# EAGLE schematic DevBoard Schematic (EAGLE 9.7.0)
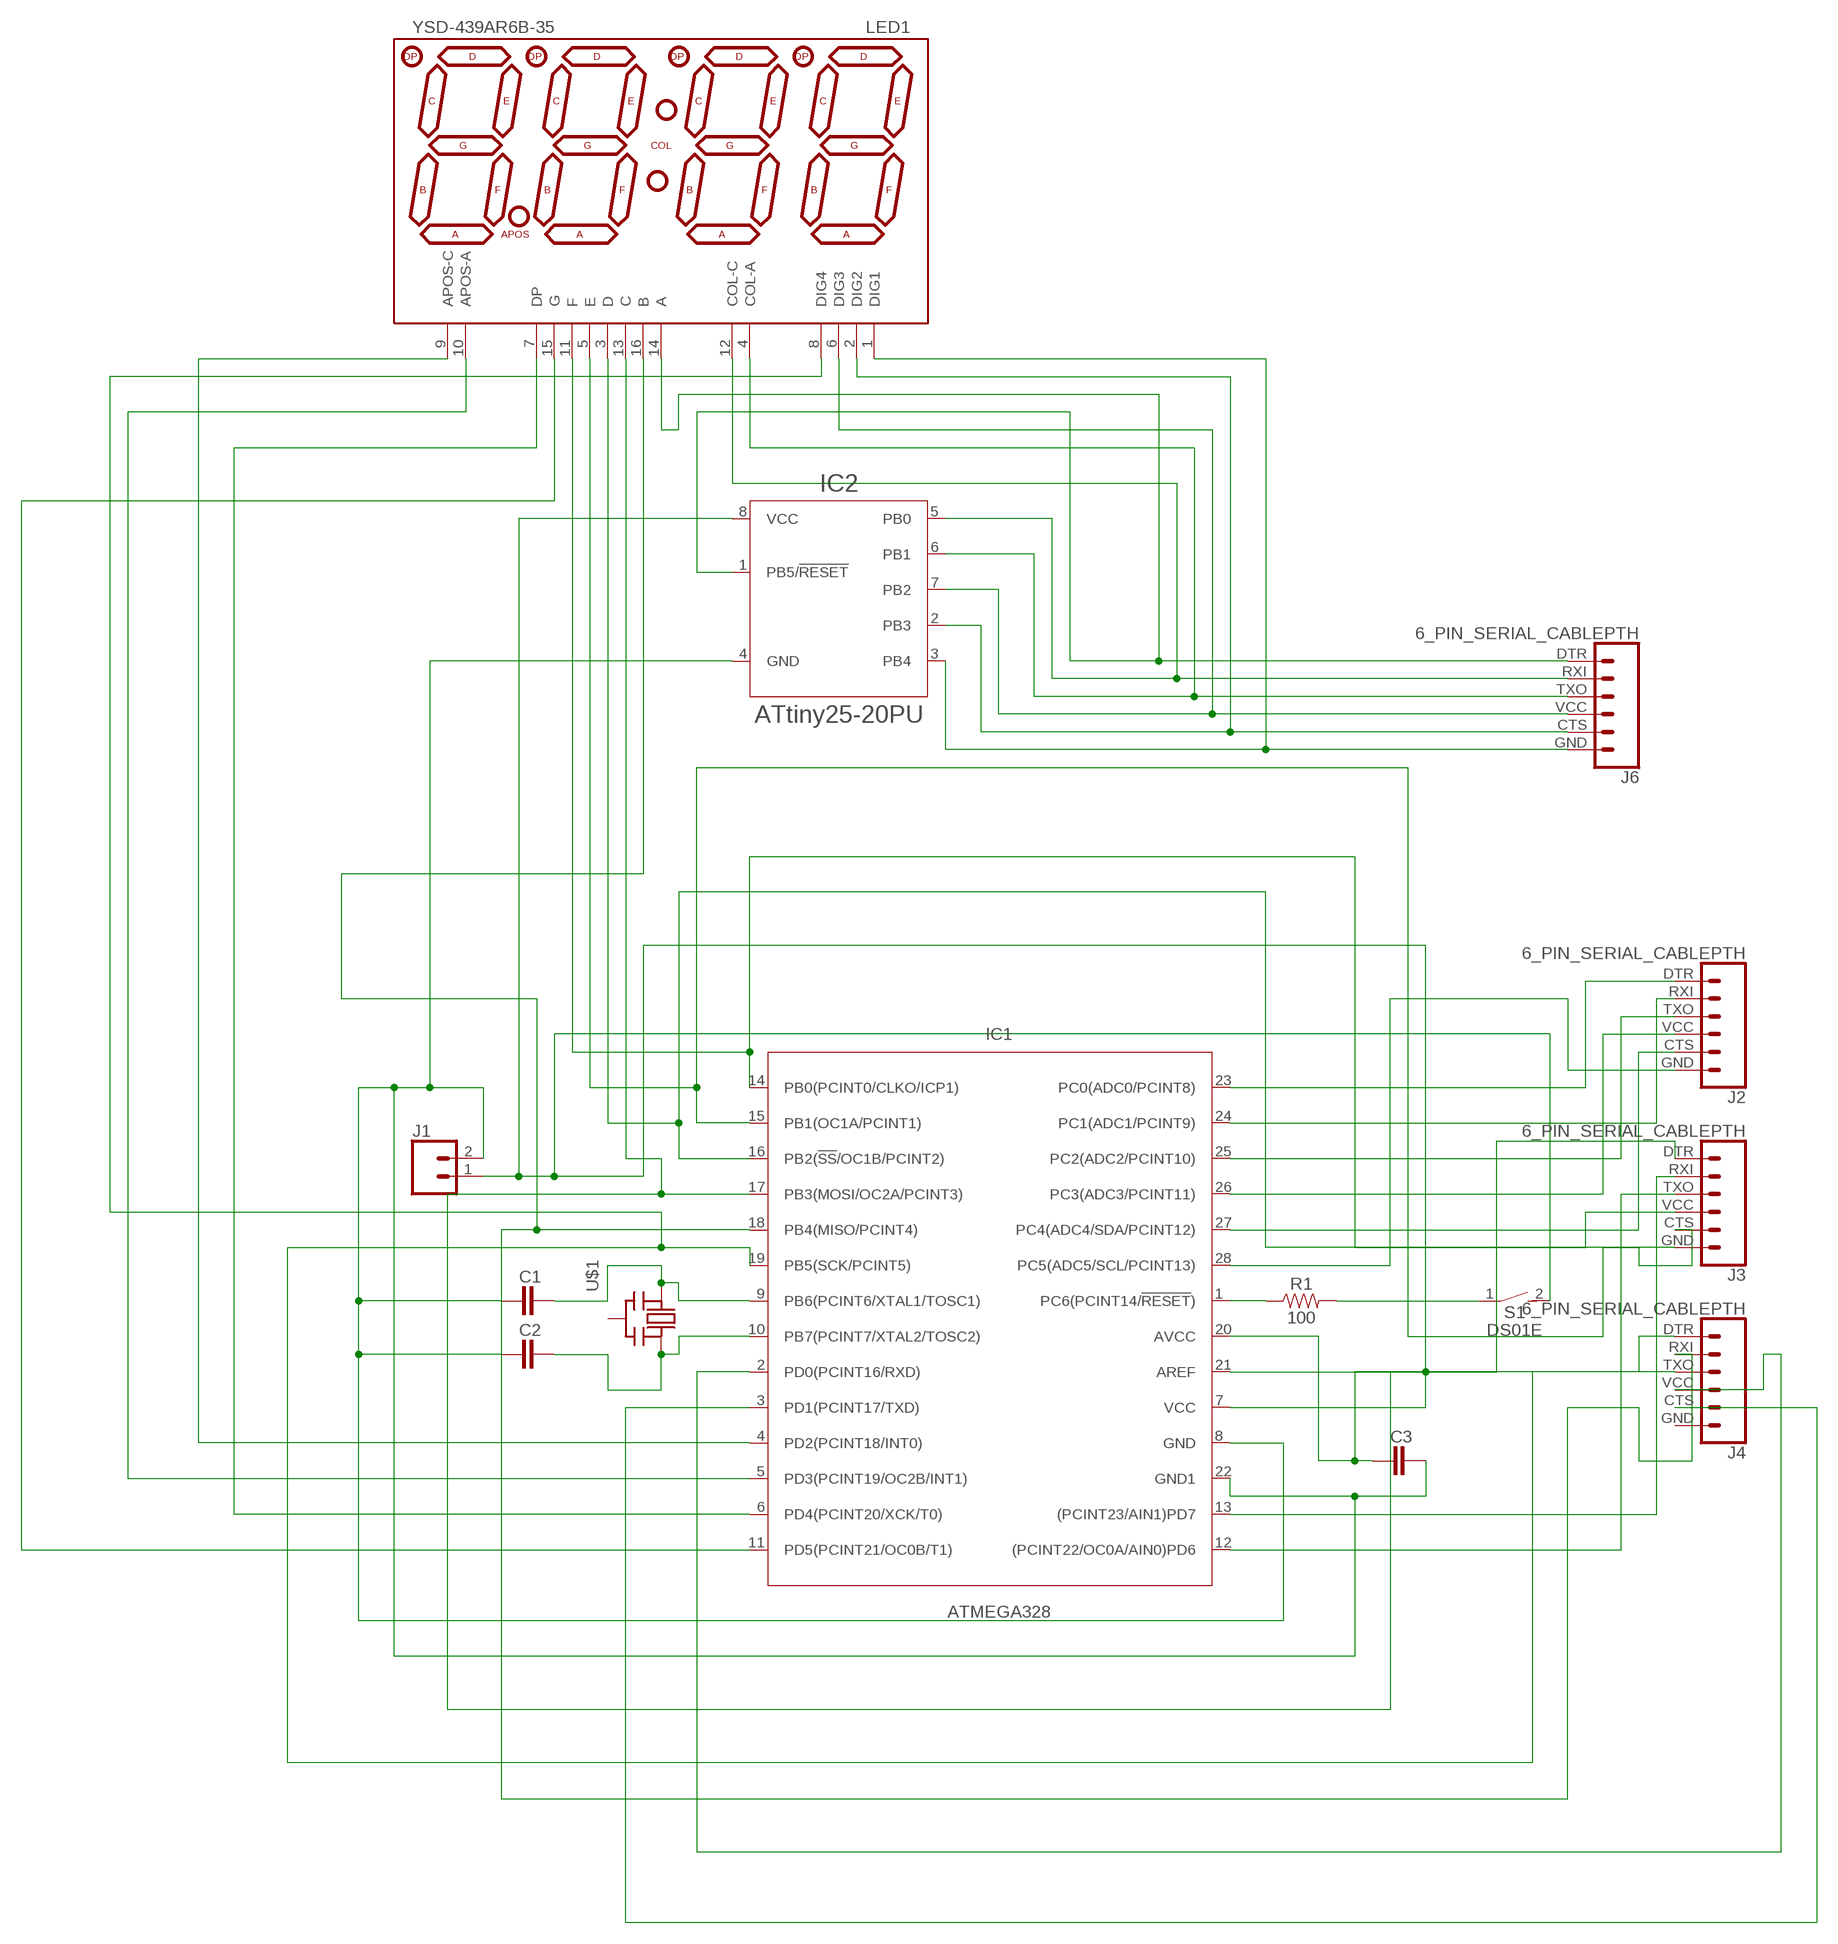
[diagram p0: schematic, sheet 1]

## Parts
C1  CAPACITORCERAMIC-2.54MM  [CAP-THRU-2.54MM]
C2  CAPACITORCERAMIC-2.54MM  [CAP-THRU-2.54MM]
C3  CAPACITORCERAMIC-2.54MM  [CAP-THRU-2.54MM]
IC1  ATMEGA328  ATMEGA328_DIP  [DIP1016W53P254L3467H457Q28B]
IC2  ATtiny25-20PU  ATTINY25-20PU-8P_PDIP  [DIP787W55P254L958H533Q8B-8P3]
J1  CONN_02  [1X02]
J2  6_PIN_SERIAL_CABLEPTH  [FTDI_BASIC]
J3  6_PIN_SERIAL_CABLEPTH  [FTDI_BASIC]
J4  6_PIN_SERIAL_CABLEPTH  [FTDI_BASIC]
J6  6_PIN_SERIAL_CABLEPTH  [FTDI_BASIC]
LED1  YSD-439AR6B-35  7-SEGMENT-4DIGIT-10MM-RED  [7-SEGMENT-4DIGIT-YOUNGSUN]
R1  100  100OHM-HORIZ-1/4W-1%  [AXIAL-0.3]
S1  DS01E  [DS-01]
U$1  CERMOSCILL-THM  [CERM_OSC]

## Nets
N$1: C1.1 IC1.9(PB6(PCINT6/XTAL1/TOSC1)) U$1.P$1(IN)
N$2: C2.1 IC1.10(PB7(PCINT7/XTAL2/TOSC2)) U$1.P$3(OUT)
N$3: IC1.23(PC0(ADC0/PCINT8)) J2.DTR
N$4: C3.2 IC1.7(VCC) IC1.20(AVCC) IC2.8(VCC) J1.1 S1.2
N$5: IC1.1(PC6(PCINT14/!RESET!)) R1.P$1
N$6: R1.P$2 S1.1
N$7: IC1.24(PC1(ADC1/PCINT9)) J2.RXI
N$8: C1.2 C2.2 C3.1 IC1.8(GND) IC1.22(GND1) IC2.4(GND) J1.2
N$9: IC1.25(PC2(ADC2/PCINT10)) J2.TXO
N$10: IC1.26(PC3(ADC3/PCINT11)) J2.VCC
N$11: IC1.27(PC4(ADC4/SDA/PCINT12)) J2.CTS
N$12: IC1.28(PC5(ADC5/SCL/PCINT13)) J2.GND
N$13: IC1.21(AREF) J3.DTR
N$14: IC1.13((PCINT23/AIN1)PD7) J3.RXI
N$15: IC1.12((PCINT22/OC0A/AIN0)PD6) J3.TXO
N$16: IC1.14(PB0(PCINT0/CLKO/ICP1)) J3.VCC LED1.11(F)
N$17: IC1.15(PB1(OC1A/PCINT1)) J3.CTS LED1.5(E)
N$18: IC1.16(PB2(!SS!/OC1B/PCINT2)) J3.GND LED1.3(D)
N$19: IC1.17(PB3(MOSI/OC2A/PCINT3)) J4.DTR LED1.13(C)
N$20: IC1.18(PB4(MISO/PCINT4)) J4.RXI LED1.16(B)
N$21: IC1.19(PB5(SCK/PCINT5)) J4.TXO LED1.8(DIG4)
N$22: IC1.2(PD0(PCINT16/RXD)) J4.VCC
N$23: IC1.3(PD1(PCINT17/TXD)) J4.CTS
N$24: IC2.3(PB4) J6.GND LED1.1(DIG1)
N$25: IC2.2(PB3) J6.CTS LED1.2(DIG2)
N$26: IC2.7(PB2) J6.VCC LED1.6(DIG3)
N$27: IC2.6(PB1) J6.TXO LED1.4(COL-A)
N$28: IC2.5(PB0) J6.RXI LED1.12(COL-C)
N$29: IC2.1(PB5/!RESET!) J6.DTR LED1.14(A)
N$30: IC1.4(PD2(PCINT18/INT0)) LED1.9(APOS-C)
N$31: IC1.5(PD3(PCINT19/OC2B/INT1)) LED1.10(APOS-A)
N$32: IC1.6(PD4(PCINT20/XCK/T0)) LED1.7(DP)
N$33: IC1.11(PD5(PCINT21/OC0B/T1)) LED1.15(G)
Unconnected: J4.GND U$1.P$2(GND)

## Library data of the parts
C1-C3 = Tinkercad:CAPACITOR: Capacitor - Generic
IC1 = IC_Embedded:ATMEGA328: 8-bit AVR Microcontroller with 32K Bytes In-System Programmable Flash Datasheet <http://ww1.microchip.com/downloads/en/DeviceDoc/ATmega48A-PA-88A-PA-168A-PA-328-P-DS-DS40002061A.pdf>; CATEGORY: IC_Embedded; MANUFACTURER: Microchip Technologies; MPN: ATmega328-PN; OPERATING_TEMP: –40 to +105°C; PART_STATUS: Active; SUB-CATEGORY: Microcontroller
IC2 = Tinkercad:ATTINY*-8P: Atmel tiny25/45/85, 8-bit AVR Microcontroller with 2/4/8K Bytes In-System Programmable Flash Datasheet <https://ww1.microchip.com/downloads/en/DeviceDoc/Atmel-2586-AVR-8-bit-Microcontroller-ATtiny25-ATtiny45-ATtiny85_Datasheet.pdf>; CATEGORY: IC_Embedded; CORE: AVR; DESCRIPTION: AVR AVR® ATtiny, Functional Safety (FuSa) Microcontroller IC 8-Bit 20MHz 2KB (1K x 16) FLASH 8-PDIP; MANUFACTURER: Microchip Technology; MPN: ATtiny25-20PU; OPERATING_TEMP: -40°C to 85°C; PART_STATUS: Active; ROHS_COMPLIANT: COMPLIANT; SERIES: ATtiny25; SPEED: 20 MHz; SUB-CATEGORY: Microcontroller; TYPE: AVR Microcontroller
J1 = SparkFun-Connectors:CONN_02: Multi connection point. Often used as Generic Header-pin footprint for 0.1 inch spaced/style header connections On any of the 0.1 inch spaced packages, you can populate with these: Break Away Headers - Straight <https://www.sparkfun.com/products/116> (PRT-00116) Break Away Male Headers - Right Angle <https://www.sparkfun.com/products/553> (PRT-00553) Female Headers <https://www.sparkfun.com/products/115> (PRT-00115) Break Away Headers - Machine Pin <https://www.sparkfun.com/products/117> (PRT-00117) Break Away Female Headers - Swiss Machine Pin <https://www.sparkfun.com/products/743> (PRT-00743) For SCREWTERMINALS and SPRING TERMINALS visit here: Screw Terimnals on SparkFun.com <https://www.sparkfun.com/search/results?term=Screw+Terminals> (5mm/3.5mm/2.54mm spacing) This device is also useful as a general connection point to wire up your design to another part of your project. Our various solder wires solder well into these plated through hole pads. Hook-Up Wire - Assortment (Stranded, 22 AWG) <https://www.sparkfun.com/products/11375> (PRT-11375) Hook-Up Wire - Assortment (Solid Core, 22 AWG) <https://www.sparkfun.com/products/11367> (PRT-11367) View the entire wire category on our website here <https://www.sparkfun.com/categories/141> Special notes: Molex polarized connector foot print use with: PRT-08233 with associated crimp pins and housings. 2.54_SCREWTERM for use with PRT-10571. 3.5mm Screw Terminal footprints for PRT-08084 5mm Screw Terminal footprints for use with PRT-08432
J2-J4 J6 = SparkFun-Connectors:6_PIN_SERIAL_CABLE: 6-pin header connection for use with the "FTDI BASIC" pinout - CABLE SIDE. Also known as "Arduino Serial Program Header". This is used on a design to provide a 6-pin connection point for serial communication usually from a USB cable (D+/D-) to these headers (RX/TX). It also has the remaining pins necessary for programming in the Arduino evironment (DTR, GND, and sometimes VCC). Note, this device has "CABLE" in the name. It is intended to be used on a design that usually lives on the end of your USB cable and prvides the converter chip (FTDI232 or FTDI231x) to commnicate serial RX/TX. The "sister" device, named "TARGET" is inteneded to be used on a design that contains a target micro-controller that you wish to program. You can populate with some of these: Female Headers <https://www.sparkfun.com/products/115> (PRT-00115) For reference (or to suit your programming needs) check out these designs: SparkFun FTDI Basic Breakout - 5V <https://www.sparkfun.com/products/9716> (DEV-09716) SparkFun FTDI Basic Breakout - 3.3V <https://www.sparkfun.com/products/9873> (DEV-09873) SparkFun FTDI SmartBasic <https://www.sparkfun.com/products/12935> (DEV-12935) SparkFun Beefy 3 - FTDI Basic Breakout <https://www.sparkfun.com/products/13746> (DEV-13746)
LED1 = SparkFun-LED:7-SEGMENT-4DIGIT-10MM: 4 Digit 7 Segment Display This is a part for the 4-Digit 7-segment LEDs from Young Sun. Different from the Digikey LEDs, all 16 pins are used. The LONGPADS Variant is used for a test jig, but you may like it because there is more pad to solder to. If you are concerned about routing space, the standard works just fine though. Datasheets: Red <http://www.sparkfun.com/datasheets/Components/LED/7-Segment/YSD-439AR6B-35.pdf> Yellow <http://www.sparkfun.com/datasheets/Components/LED/7-Segment/YSD-439AY2B-35.pdf> Kelly Green <http://www.sparkfun.com/datasheets/Components/LED/7-Segment/YSD-439AK2B-35.pdf> Blue <http://www.sparkfun.com/datasheets/Components/LED/7-Segment/YSD-439AB4B-35.pdf> White <http://cdn.sparkfun.com/datasheets/Components/LED/ATA3492BW_2.pdf> SparkFun Products Raw Components 7-Segment Display - 4-Digit (Red) <https://www.sparkfun.com/products/9483> (COM-09483) 7-Segment Display - 4-Digit (Yellow) <https://www.sparkfun.com/products/9480> (COM-09480) 7-Segment Display - 4-Digit (Kelly Green) <https://www.sparkfun.com/products/9482> (COM-09482) 7-Segment Display - 4-Digit (Blue) <https://www.sparkfun.com/products/9481> (COM-09481) 7-Segment Display - 4-Digit (White) <https://www.sparkfun.com/products/10931> ( COM-10931) Serial Controlled SparkFun 7-Segment Serial Display - Red <https://www.sparkfun.com/products/11441> (COM-11441) SparkFun 7-Segment Serial Display - Yellow <https://www.sparkfun.com/products/11443> (COM-11443) SparkFun 7-Segment Serial Display - Kelly Green <https://www.sparkfun.com/products/11440> (COM-11440) SparkFun 7-Segment Serial Display - Blue <https://www.sparkfun.com/products/11442> (COM-11442) SparkFun 7-Segment Serial Display - White <https://www.sparkfun.com/products/11629> (COM-11629) Other SparkFun BigTime Watch Kit <https://www.sparkfun.com/products/11734> (KIT-11734); PROD_ID: COMP-09493
R1 = SparkFun-Resistors:100OHM: 100Ω resistor A resistor is a passive two-terminal electrical component that implements electrical resistance as a circuit element. Resistors act to reduce current flow, and, at the same time, act to lower voltage levels within circuits. - Wikipedia; PROD_ID: RES-12181
S1 = Switch:DS01E: DIL/CODE SWITCH; CATEGORY: Switches; MANUFACTURER: Multicomp Pro; OPERATING_TEMPERATURE: -40°C ~ 85°C; PACKAGE_SIZE: NA; PACKAGE_TYPE: THT; PART_STATUS: OBSOLETE; ROHS: COMPLIANT; SUBCATEGORY: DIP Switches; TYPE: SPST-NO
U$1 = adafruit:CERMOSCILL: Ceramic oscillator with built in capacitors such as ZTT-12MHz http://www.ladyada.net/library/eagle